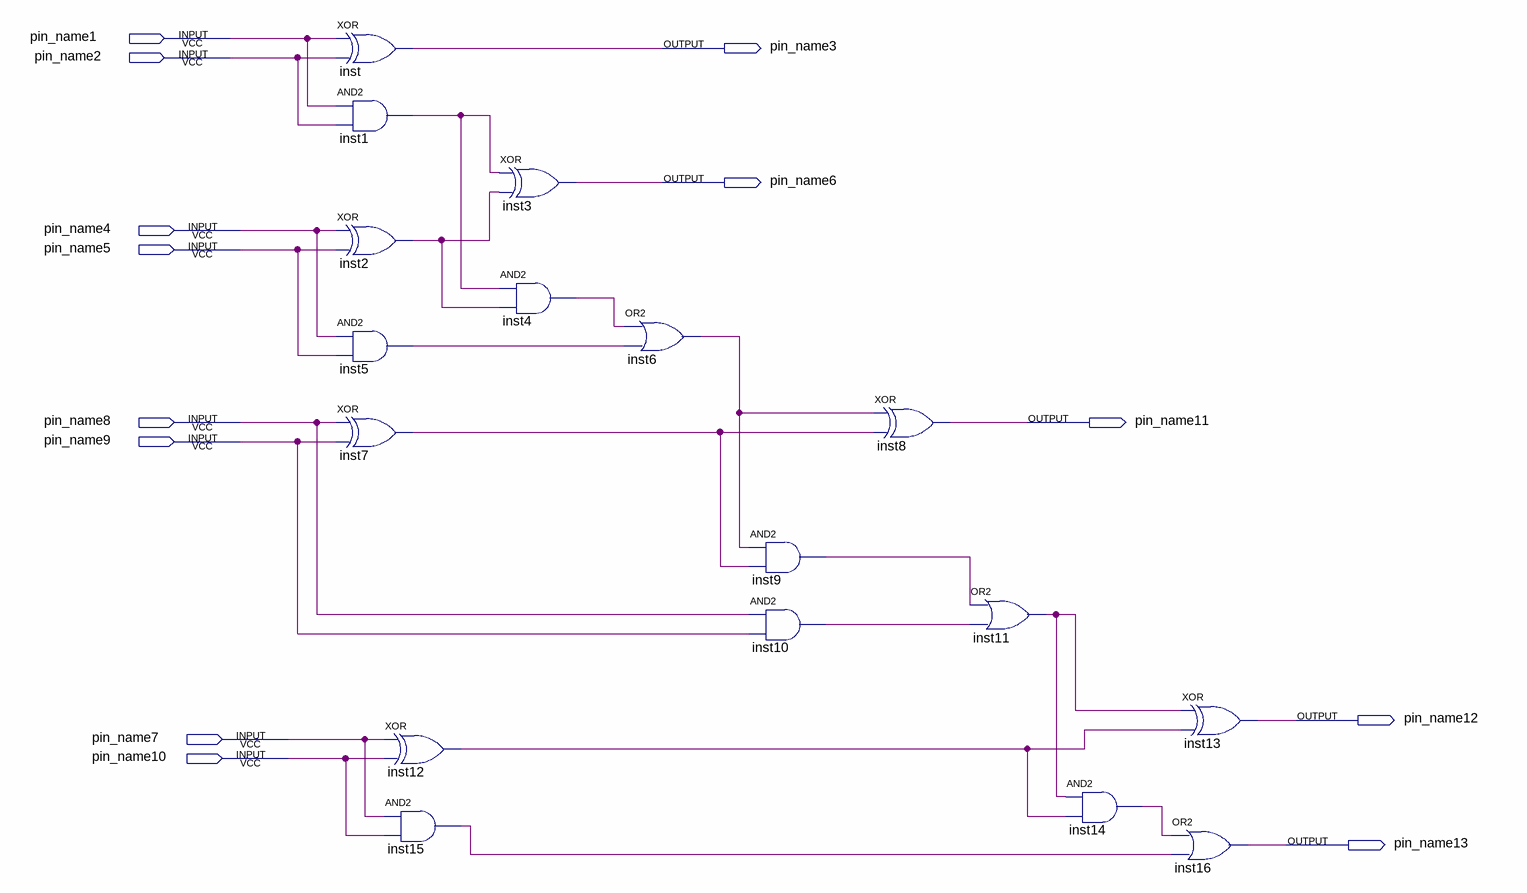
[diagram p0: schematic sheet]
// Quartus schematic Adder_4bit.bdf as structural Verilog: 17 symbols, 13 pins
module Adder_4bit (
  input  pin_name1,
  input  pin_name2,
  input  pin_name4,
  input  pin_name5,
  input  pin_name8,
  input  pin_name9,
  input  pin_name7,
  input  pin_name10,
  output pin_name3,
  output pin_name6,
  output pin_name11,
  output pin_name12,
  output pin_name13
);

  wire inst1_out, inst2_out, inst4_out, inst5_out, inst6_out, inst7_out, inst9_out, inst10_out, inst11_out,
       inst12_out, inst14_out, inst15_out;

  xor inst (pin_name3, pin_name1, pin_name2);
  and inst1 (inst1_out, pin_name1, pin_name2);
  xor inst2 (inst2_out, pin_name4, pin_name5);
  and inst5 (inst5_out, pin_name4, pin_name5);
  xor inst7 (inst7_out, pin_name8, pin_name9);
  xor inst12 (inst12_out, pin_name7, pin_name10);
  and inst15 (inst15_out, pin_name7, pin_name10);
  xor inst3 (pin_name6, inst1_out, inst2_out);
  and inst4 (inst4_out, inst1_out, inst2_out);
  or inst6 (inst6_out, inst4_out, inst5_out);
  and inst9 (inst9_out, inst6_out, inst7_out);
  and inst10 (inst10_out, pin_name8, pin_name9);
  xor inst8 (pin_name11, inst6_out, inst7_out);
  or inst11 (inst11_out, inst9_out, inst10_out);
  and inst14 (inst14_out, inst11_out, inst12_out);
  xor inst13 (pin_name12, inst11_out, inst12_out);
  or inst16 (pin_name13, inst14_out, inst15_out);
endmodule
